# EAGLE design ThermalPrinter (EAGLE 7.6.0)
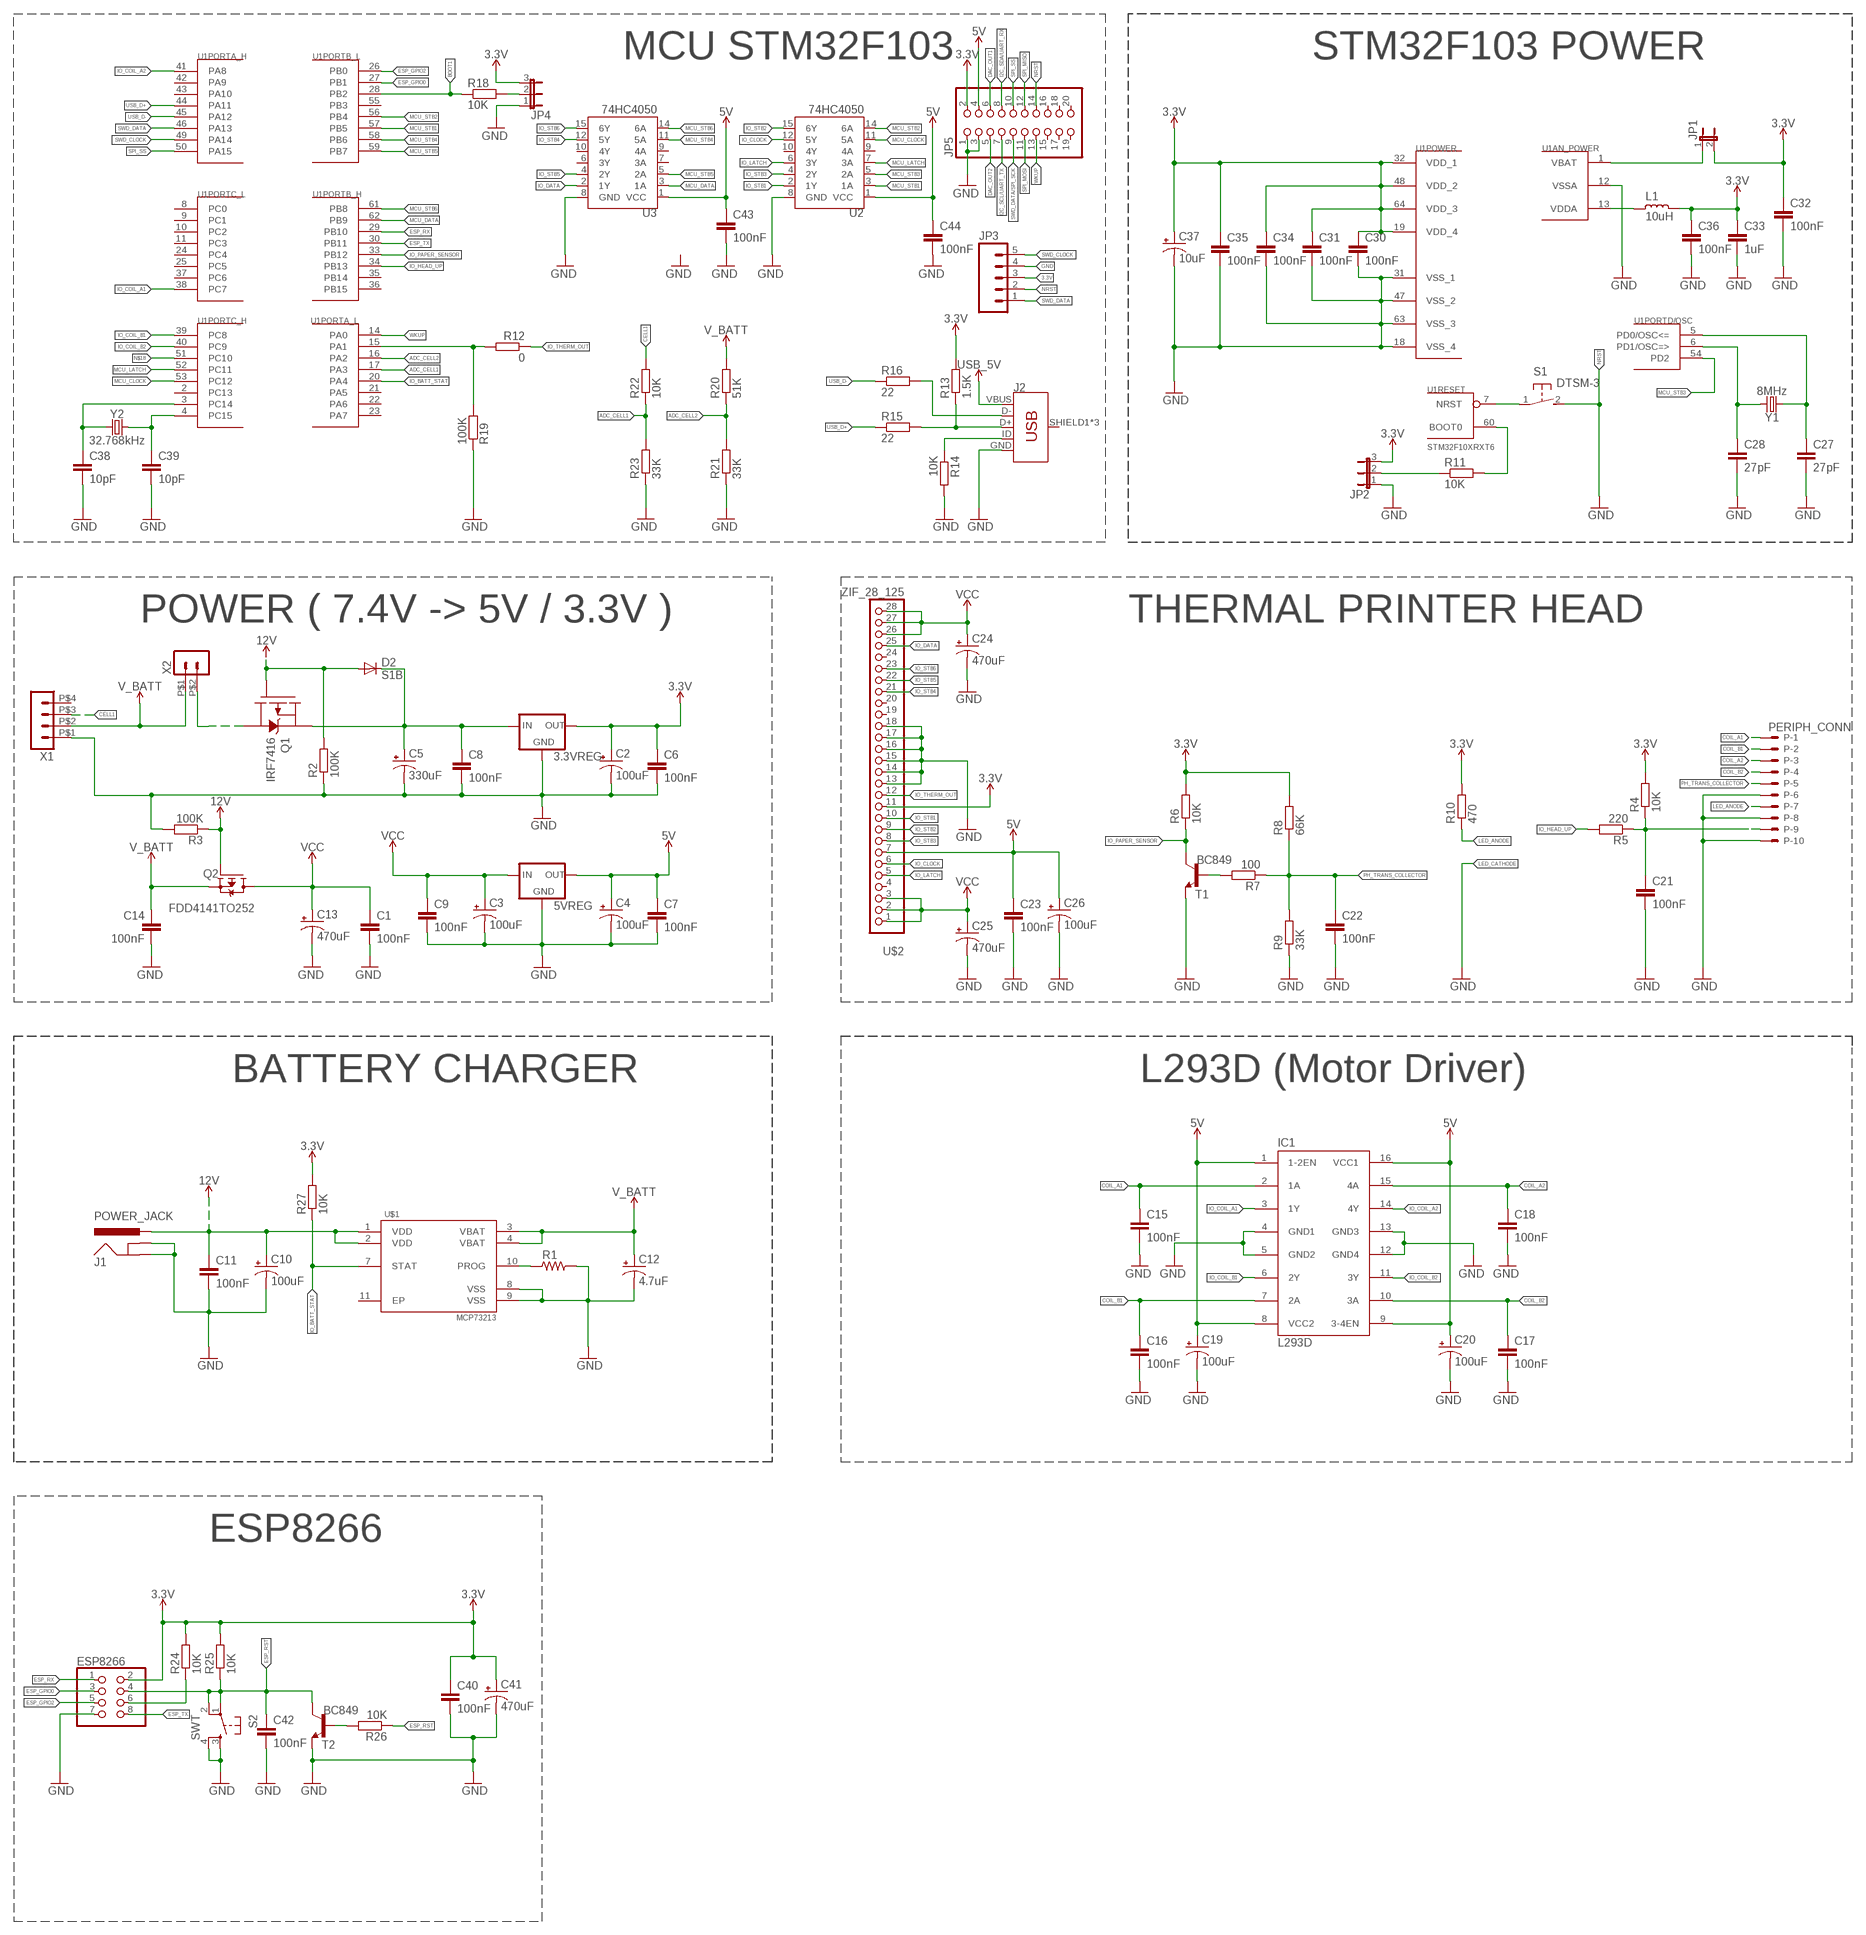
[diagram p0: schematic, sheet 1]

## Parts
3.3VREG  LM1117TO252  [TO252]
5VREG  LM1117TO252  [TO252]
C1  100nF  C-EUC0805K  [C0805K]
C2  100uF  100UF-POLAR-RADIAL-2.5MM-25V-20%  [CPOL-RADIAL-2.5MM-6.5MM]
C3  100uF  100UF-POLAR-RADIAL-2.5MM-25V-20%  [CPOL-RADIAL-2.5MM-6.5MM]
C4  100uF  100UF-POLAR-RADIAL-2.5MM-25V-20%  [CPOL-RADIAL-2.5MM-6.5MM]
C5  330uF  100UF-POLAR-RADIAL-2.5MM-25V-20%  [CPOL-RADIAL-2.5MM-6.5MM]
C6  100nF  C-EUC0805K  [C0805K]
C7  100nF  C-EUC0805K  [C0805K]
C8  100nF  C-EUC0805K  [C0805K]
C9  100nF  C-EUC0805K  [C0805K]
C10  100uF  100UF-POLAR-RADIAL-2.5MM-25V-20%  [CPOL-RADIAL-2.5MM-6.5MM]
C11  100nF  C-EUC0805K  [C0805K]
C12  4.7uF  100UF-POLAR-RADIAL-2.5MM-25V-20%  [CPOL-RADIAL-2.5MM-6.5MM]
C13  470uF  100UF-POLAR-RADIAL-2.5MM-25V-20%  [CPOL-RADIAL-2.5MM-6.5MM]
C14  100nF  C-EUC0805K  [C0805K]
C15  100nF  C-EUC0805K  [C0805K]
C16  100nF  C-EUC0805K  [C0805K]
C17  100nF  C-EUC0805K  [C0805K]
C18  100nF  C-EUC0805K  [C0805K]
C19  100uF  100UF-POLAR-RADIAL-2.5MM-25V-20%  [CPOL-RADIAL-2.5MM-6.5MM]
C20  100uF  100UF-POLAR-RADIAL-2.5MM-25V-20%  [CPOL-RADIAL-2.5MM-6.5MM]
C21  100nF  C-EUC0805K  [C0805K]
C22  100nF  C-EUC0805K  [C0805K]
C23  100nF  C-EUC0805K  [C0805K]
C24  470uF  100UF-POLAR-RADIAL-2.5MM-25V-20%  [CPOL-RADIAL-2.5MM-6.5MM]
C25  470uF  100UF-POLAR-RADIAL-2.5MM-25V-20%  [CPOL-RADIAL-2.5MM-6.5MM]
C26  100uF  100UF-POLAR-RADIAL-2.5MM-25V-20%  [CPOL-RADIAL-2.5MM-6.5MM]
C27  27pF  C-EUC0603  [C0603]
C28  27pF  C-EUC0603  [C0603]
C30  100nF  C-EUC0805K  [C0805K]
C31  100nF  C-EUC0805K  [C0805K]
C32  100nF  C-EUC0805K  [C0805K]
C33  1uF  2.2UF-CERCAP-10009  [1206]
C34  100nF  C-EUC0805K  [C0805K]
C35  100nF  C-EUC0805K  [C0805K]
C36  100nF  C-EUC0805K  [C0805K]
C37  10uF  10UF-TANT  [EIA3216]
C38  10pF  C-EUC0603  [C0603]
C39  10pF  C-EUC0603  [C0603]
C40  100nF  C-EUC0805K  [C0805K]
C41  470uF  100UF-POLAR-RADIAL-2.5MM-25V-20%  [CPOL-RADIAL-2.5MM-6.5MM]
C42  100nF  C-EUC0805K  [C0805K]
C43  100nF  C-EUC0805K  [C0805K]
C44  100nF  C-EUC0805K  [C0805K]
D2  S1B  [DO214AC]
ESP8266  PINHD-2X4  [2X04]
IC1  L293D  [DIL16]
J1  POWER_JACK  [POWER_JACK_PTH]
J2  USB_MICRO-B_FEMALE-SMT  [USB-B-MICRO-SMD]
JP1  JP1E  [JP1]
JP2  JP2E  [JP2]
JP3  M05PTH  [1X05]
JP4  JP2E  [JP2]
JP5  PINHD-2X10  [2X10]
L1  10uH  L_0603  [L0603]
P  PERIPH_CONN  53261-10  [53261-10]
Q1  IRF7416  [SO8-IRFET-1]
Q2  FDD4141TO252  [TO252]
R1  R_0805  [R0805]
R2  100K  R-EU_R0805  [R0805]
R3  100K  R-EU_R0805  [R0805]
R4  10K  R-EU_R0603  [R0603]
R5  220  R-EU_R0603  [R0603]
R6  10K  R-EU_R0603  [R0603]
R7  100  R-EU_R0603  [R0603]
R8  66K  R-EU_R0603  [R0603]
R9  33K  R-EU_R0603  [R0603]
R10  470  R-EU_R0603  [R0603]
R11  10K  R-EU_R0603  [R0603]
R12  0  R-EU_R0603  [R0603]
R13  1.5K  R-EU_R0603  [R0603]
R14  10K  R-EU_R0603  [R0603]
R15  22  R-EU_R0603  [R0603]
R16  22  R-EU_R0603  [R0603]
R18  10K  R-EU_R0603  [R0603]
R19  100K  R-EU_R0603  [R0603]
R20  51K  R-EU_R0603  [R0603]
R21  33K  R-EU_R0603  [R0603]
R22  10K  R-EU_R0603  [R0603]
R23  33K  R-EU_R0603  [R0603]
R24  10K  R-EU_R0603  [R0603]
R25  10K  R-EU_R0603  [R0603]
R26  10K  R-EU_R0603  [R0603]
R27  10K  R-EU_R0603  [R0603]
S1  DTSM-3  [DTSM-3]
S2  SWT  TAC_SWITCHSMD  [TACTILE-SWITCH-SMD]
T1  BC849  [SOT23]
T2  BC849  [SOT23]
U1  STM32F10XRXT6  [TQFP64]
U2  74HC4050  HEX_CONVERTER  [SO16]
U3  74HC4050  HEX_CONVERTER  [SO16]
U$1  MCP73213  [MCP73213]
U$2  ZIF_28_125  [ZIF_CONN_125]
X1  HEADER_POS4_44914-0401  [44914-0401]
X2  HEADER_POS2_43650-0215  [43650-0215]
Y1  8MHz  CRYSTAL-8MHZSMD-HC49UP  [HC49UP]
Y2  32.768kHz  CRYSTAL-32.768KHZSMD-2X6  [CRYSTAL-SMD-2X6-CYL]

## Nets
3.3V: 3.3VREG.3(OUT) C2.1(+) C6.1 C30.1 C31.1 C32.1 C33.1 C34.1 C35.1 C36.1 C37.A(+) C40.1 C41.1(+) ESP8266.2 JP1.2 JP2.3 JP3.3 JP4.3 JP5.2 L1.1 R4.2 R6.2 R8.2 R10.2 R13.2 R24.2 R25.2 R27.2 U1.19(POWER:VDD_4) U1.32(POWER:VDD_1) U1.48(POWER:VDD_2) U1.64(POWER:VDD_3) U$2.11
5V: 5VREG.3(OUT) C4.1(+) C7.1 C19.1(+) C20.1(+) C23.1 C26.1(+) C43.1 C44.1 IC1.1(1-2EN) IC1.8(VCC2) IC1.9(3-4EN) IC1.16(VCC1) JP5.4 U2.1(VCC) U3.1(VCC) U$2.7
12V: C10.1(+) C11.1 D2.A J1.PWR Q1.GATE(G) Q2.1(G) R2.2 R3.1 U$1.1(VDD) U$1.2(VDD)
ADC_CELL1: R22.1 R23.2 U1.17(PORTA_L:PA3)
ADC_CELL2: R20.1 R21.2 U1.16(PORTA_L:PA2)
BOOT1: R18.1 U1.28(PORTB_L:PB2)
CELL1: R22.2 X1.P$3
COIL_A1: C15.1 IC1.2(1A) P.1
COIL_A2: C18.1 IC1.15(4A) P.3
COIL_B1: C16.1 IC1.7(2A) P.2
COIL_B2: C17.1 IC1.10(3A) P.4
D+: J2.D+ R13.1 R15.2
DAC_OUT1: JP5.6
DAC_OUT2: JP5.5
ESP_CH_PD: ESP8266.6 R24.1
ESP_GPIO0: ESP8266.3 U1.27(PORTB_L:PB1)
ESP_GPIO2: ESP8266.5 U1.26(PORTB_L:PB0)
ESP_RST: C42.1 ESP8266.4 R25.1 R26.1 S2.1 S2.2 T2.3(C)
ESP_RX: ESP8266.1 U1.29(PORTB_H:PB10)
ESP_TX: ESP8266.8 U1.30(PORTB_H:PB11)
GND: 3.3VREG.1(GND) 5VREG.1(GND) C1.2 C2.2(-) C3.2(-) C4.2(-) C5.2(-) C6.2 C7.2 C8.2 C9.2 C10.2(-) C11.2 C12.2(-) C13.2(-) C14.2 C15.2 C16.2 C17.2 C18.2 C19.2(-) C20.2(-) C21.2 C22.2 C23.2 C24.2(-) C25.2(-) C26.2(-) C27.2 C28.2 C30.2 C31.2 C32.2 C33.2 C34.2 C35.2 C36.2 C37.C(-) C38.2 C39.2 C40.2 C41.2(-) C42.2 C43.2 C44.2 ESP8266.7 IC1.4(GND1) IC1.5(GND2) IC1.12(GND4) IC1.13(GND3) J1.GND J1.GNDBREAK J2.GND JP2.1 JP3.4 JP4.1 JP5.1 JP5.3 P.6 P.8 P.10 R1.2 R2.1 R3.2 R9.1 R14.2 R19.1 R21.1 R23.1 S2.3 S2.4 T1.2(E) T2.2(E) U1.12(AN_POWER:VSSA) U1.18(POWER:VSS_4) U1.31(POWER:VSS_1) U1.47(POWER:VSS_2) U1.63(POWER:VSS_3) U2.8(GND) U3.8(GND) U$1.8(VSS) U$1.9(VSS) U$2.13 U$2.14 U$2.15 U$2.16 U$2.17 U$2.18 X1.P$1
HEAD_UP_IN: C21.1 P.9 R4.1 R5.1
I2C_SCL/UART_TX: JP5.7
I2C_SDA/UART_RX: JP5.8
IO_BATT_STAT: R27.1 U1.20(PORTA_L:PA4) U$1.7(STAT)
IO_CLOCK: U2.12(5Y) U$2.6
IO_COIL_A1: IC1.3(1Y) U1.38(PORTC_L:PC7)
IO_COIL_A2: IC1.14(4Y) U1.41(PORTA_H:PA8)
IO_COIL_B1: IC1.6(2Y) U1.39(PORTC_H:PC8)
IO_COIL_B2: IC1.11(3Y) U1.40(PORTC_H:PC9)
IO_DATA: U3.2(1Y) U$2.25
IO_HEAD_UP: R5.2 U1.34(PORTB_H:PB13)
IO_LATCH: U2.6(3Y) U$2.5
IO_PAPER_SENSOR: R6.1 T1.3(C) U1.33(PORTB_H:PB12)
IO_STB1: U2.2(1Y) U$2.10
IO_STB2: U2.15(6Y) U$2.9
IO_STB3: U2.4(2Y) U$2.8
IO_STB4: U3.12(5Y) U$2.21
IO_STB5: U3.4(2Y) U$2.22
IO_STB6: U3.15(6Y) U$2.23
IO_THERM_OUT: R12.1 U$2.12
LED_ANODE: P.7 R10.1
MCU_CLOCK: U1.53(PORTC_H:PC12) U2.11(5A)
MCU_DATA: U1.62(PORTB_H:PB9) U3.3(1A)
MCU_LATCH: U1.52(PORTC_H:PC11) U2.7(3A)
MCU_STB1: U1.57(PORTB_L:PB5) U2.3(1A)
MCU_STB2: U1.56(PORTB_L:PB4) U2.14(6A)
MCU_STB3: U1.54(PORTD/OSC:PD2) U2.5(2A)
MCU_STB4: U1.58(PORTB_L:PB6) U3.11(5A)
MCU_STB5: U1.59(PORTB_L:PB7) U3.5(2A)
MCU_STB6: U1.61(PORTB_H:PB8) U3.14(6A)
N$1: S1.1 U1.7(RESET:NRST)
N$2: 3.3VREG.2(IN) C5.1(+) C8.1 D2.C Q1.SOURCE-1(S)
N$3: R7.2 T1.1(B)
N$4: R1.1 U$1.10(PROG)
N$5: C28.1 U1.6(PORTD/OSC:PD1/OSC=>) Y1.2
N$6: L1.2 U1.13(AN_POWER:VDDA)
N$7: C27.1 U1.5(PORTD/OSC:PD0/OSC<=) Y1.1
N$8: JP1.1 U1.1(AN_POWER:VBAT)
N$9: Q1.DRAIN-4(D) X2.P$2
N$10: C38.1 U1.3(PORTC_H:PC14) Y2.X2
N$11: C39.1 U1.4(PORTC_H:PC15) Y2.X1
N$12: J2.ID R14.1
N$14: J2.D- R16.2
N$15: JP4.2 R18.2
N$16: R11.2 U1.60(RESET:BOOT0)
N$17: R26.2 T2.1(B)
N$18: U1.51(PORTC_H:PC10)
N$19: JP2.2 R11.1
N$20: R12.2 R19.2 U1.15(PORTA_L:PA1)
NRST: JP3.2 JP5.14 S1.2 ; supply symbol labelled GND
PH_TRANS_COLLECTOR: C22.1 P.5 R7.1 R8.1 R9.2
SPI_MISO: JP5.12
SPI_MOSI: JP5.11
SPI_SS: JP5.10 U1.50(PORTA_H:PA15)
SWD_CLOCK: JP3.5 U1.49(PORTA_H:PA14)
SWD_DATA: JP3.1 U1.46(PORTA_H:PA13)
SWD_DATA/SPI_SCK: JP5.9
USB_D+: R15.1 U1.44(PORTA_H:PA11)
USB_D-: R16.1 U1.45(PORTA_H:PA12)
V_BATT: C12.1(+) C14.1 Q2.2(S) R20.2 U$1.3(VBAT) U$1.4(VBAT) X1.P$2 X2.P$1
VCC: 5VREG.2(IN) C1.1 C3.1(+) C9.1 C13.1(+) C24.1(+) C25.1(+) Q2.3(D) U$2.1 U$2.2 U$2.3 U$2.26 U$2.27 U$2.28
VCC_2: J2.VBUS ; supply symbol labelled USB_5V
WKUP: JP5.13 U1.14(PORTA_L:PA0)
Unconnected: J2.SHIELD1(SHIELD) J2.SHIELD2(SHIELD) J2.SHIELD3(SHIELD) JP5.15 JP5.16 JP5.17 JP5.18 JP5.19 JP5.20 U1.2(PORTC_H:PC13) U1.8(PORTC_L:PC0) U1.9(PORTC_L:PC1) U1.10(PORTC_L:PC2) U1.11(PORTC_L:PC3) U1.21(PORTA_L:PA5) U1.22(PORTA_L:PA6) U1.23(PORTA_L:PA7) U1.24(PORTC_L:PC4) U1.25(PORTC_L:PC5) U1.35(PORTB_H:PB14) U1.36(PORTB_H:PB15) U1.37(PORTC_L:PC6) U1.42(PORTA_H:PA9) U1.43(PORTA_H:PA10) U1.55(PORTB_L:PB3) U2.9(4A) U2.10(4Y) U3.6(3Y) U3.7(3A) U3.9(4A) U3.10(4Y) U$1.11(EP) U$2.4 U$2.19 U$2.20 U$2.24 X1.P$4

## Notes on the sheet
- MCU STM32F103 | STM32F103 POWER
- POWER ( 7.4V -> 5V / 3.3V ) | THERMAL PRINTER HEAD
- BATTERY CHARGER | L293D (Motor Driver)
- ESP8266

## Library data of the parts
3.3VREG 5VREG = v-reg-3:LM1117
C1 C6-C9 C11 C14-C18 C21-C23 C27 C28 C30-C32 C34-C36 C38-C40 C42-C44 = rcl:C-EU: CAPACITOR, European symbol
C2-C4 C10 C19 C20 C26 = SparkFun-Capacitors:100UF-POLAR: 100µF polarized capacitors A capacitor is a passive two-terminal electrical component used to store electrical energy temporarily in an electric field.; PROD_ID: CAP-08439
C5 C12 C13 C24 C25 C41 = SparkFun-Capacitors:100UF-POLAR: 100µF polarized capacitors A capacitor is a passive two-terminal electrical component used to store electrical energy temporarily in an electric field.; PROD_ID: CAP-08439; VALUE: 100uF
C33 = SparkFun-Retired:2.2UF-CER: 2.2uF Ceramic SMT CAP-07888- 10V, 20% (0603) CAP-10009- 50V, 10% (1206); PROD_ID: CAP-10009; VALUE: 2.2uF
C37 = SparkFun-Retired:10UF-TANT: 10uF Tantalum SMT CAP-00811- 16V 10% (EIA-3216); PROD_ID: CAP-00811
D2 = s1x_10:S1*: S1A - S1M General Purpose Rectifiers Source: http://www.fairchildsemi.com/datasheets/S1/S1A.pdf; MF: Fairchild; MPN: S1B; OC_FARNELL: 2136324; OC_NEWARK: 18C8663
ESP8266 = pinhead:PINHD-2X4: PIN HEADER
IC1 = st-microelectronics:L293D: PUSH-PULL 4 CHANNEL DRIVER; MPN: L293D; OC_FARNELL: 9589619; OC_NEWARK: 56P8249
J1 = SparkFun-Connectors:POWER_JACK: Power Jack Connector This is the standard 5.5mm barrel jack for power. The PTH is the most common, proven, reliable, footprint. The Slot footprint only works if the mill layer is transmitted to the PCB fab house so be warned. Here are the connectors we sell at SparkFun: DC Barrel Power Jack/Connector <https://www.sparkfun.com/products/119> (PRT-00119) DC Barrel Power Jack/Connector (SMD) <https://www.sparkfun.com/products/12748> (PRT-12748) DC Barrel Jack Adapter - Breadboard Compatible <https://www.sparkfun.com/products/10811> (PRT-10811) It is used on this SparkFun product (and many, many others): SparkFun RedBoard - Programmed with Arduino <https://www.sparkfun.com/products/12757> (DEV-12757) Also, if you need a mating power supply or connector, please check these out: Wall Adapter Power Supply - 9VDC 650mA <https://www.sparkfun.com/products/298> (TOL-00298) DC Barrel Jack Adapter - Male <https://www.sparkfun.com/products/10287> (PRT-10287); PROD_ID: CONN-08197
J2 = SparkFun-Connectors:USB_MICRO-B: USB Type Micro-B Connector Male/female and PTH/SMT variants SparkFun Products: SparkFun microB USB Breakout <https://www.sparkfun.com/products/12035> SparkFun USB microB Plug Breakout <https://www.sparkfun.com/products/10031> SparkFun ESP8266 Thing <https://www.sparkfun.com/products/13231>; PROD_ID: CONN-11752
JP1 = jumper:JP1E: JUMPER
JP2 JP4 = jumper:JP2E: JUMPER
JP3 = SparkFun:M05: Header 5 Standard 5-pin 0.1" header. Use with straight break away headers (SKU : PRT-00116), right angle break away headers (PRT-00553), swiss pins (PRT-00743), machine pins (PRT-00117), and female headers (PRT-00115). Molex polarized connector foot print use with SKU : PRT-08230 with associated crimp pins and housings.
JP5 = pinhead:PINHD-2X10: PIN HEADER
L1 = rc-master-smd:L_: INDUCTOR
P = con-molex:53?-10: CONNECTOR wire to board 1.25 mm (.049 inch) pitch header; OC_FARNELL: unknown; OC_NEWARK: unknown
Q1 = transistor:IRF7416: P chan MOSFET, 30V, 35mOhm, 7A; DESC: MOSFET, P channel; DVAL: 30V 7A 35mOhm; SUPPLIER: Mouser:942-IRF7416TRPBF; VALSTAT: partnum
Q2 = transistor-fet:FDD4141: P-Channel PowerTrench® MOSFET Source: FDD4141.pdf
R1 = rc-master-smd:R_: RESISTOR
R2-R16 R18-R27 = resistor:R-EU_: RESISTOR, European symbol
S1 = switch-tact:DTSM-3
S2 = SparkFun-Retired:TAC_SWITCH: Momentary Switch Button commonly used for reset or general input. Spark Fun Electronics SKU : COM-00097 SMT- SWCH-08247; PROD_ID: SWCH-08247; VALUE: TAC_SWITCHSMD
T1 T2 = transistor:BC849: NPN TRANSISTOR
U1 = stm32:STM32F10XRXT6: STM32F101/103 64pin LQFP
U2 U3 = SparkFun-IC-Comms:HEX_CONVERTER: 74HC4050 Hex Buffer 74HC4050 Hex Buffer Level Shifter SMD SO016 SparkFun Products CAN-BUS Shield <https://www.sparkfun.com/products/13262> (DEV-13262) SparkFun MP3 Player Shield <https://www.sparkfun.com/products/12660> (DEV-12660) SparkFun microSD Shield <https://www.sparkfun.com/products/12761> (DEV-12761) SparkFun USB Host Shield <https://www.sparkfun.com/products/9947> (DEV-09947); PROD_ID: IC-09604
U$1 = Microchip:MCP73213
U$2 = ZIF_CONN:ZIF_28_125
X1 = con-molex-micro-fit-3_0:HEADER_POS4_?: Molex - Micro-Fit 3.0 Series connector, 3.00mm (0.118") pitch header, 4 positions.
X2 = con-molex-micro-fit-3_0:HEADER_POS2_?: Molex - Micro-Fit 3.0 Series connector, 3.00mm (0.118") pitch header, 2 positions.
Y1 = SparkFun-Clocks:CRYSTAL-8MHZ: 8MHz Crystal Datasheet Example <http://www.futureelectronics.com/en/technologies/electromechanical/timing-devices/crystals/Pages/6008189-ABM3B-8.000MHZ-B2-T.aspx?IM=0> Frequency: 8MHz Frequency Tolerance: ±20ppm Load Capacitance: 18pF SparkFun Products: Pro Micro -3.3V/8MHz <https://www.sparkfun.com/products/12587> WAV Trigger <https://www.sparkfun.com/products/13660>; PROD_ID: XTAL-11706
Y2 = SparkFun-Clocks:CRYSTAL-32.768KHZ: 32.768kHz Crystal Frequency: 32.768kHz Frequency Stability: ±20ppm Load Capacitance: 12.5pF (PTH-2X6 & SMD-3.2X1.5), 6pF (SMD-2X6) SparkFun Products: SparkFun BigTime Watch Kit <https://www.sparkfun.com/products/11734> SparkFun nRF52832 Breakout <https://www.sparkfun.com/products/13990> SparkFun Real Time Clock Module <https://www.sparkfun.com/products/12708>; PROD_ID: XTAL-07894

## Board
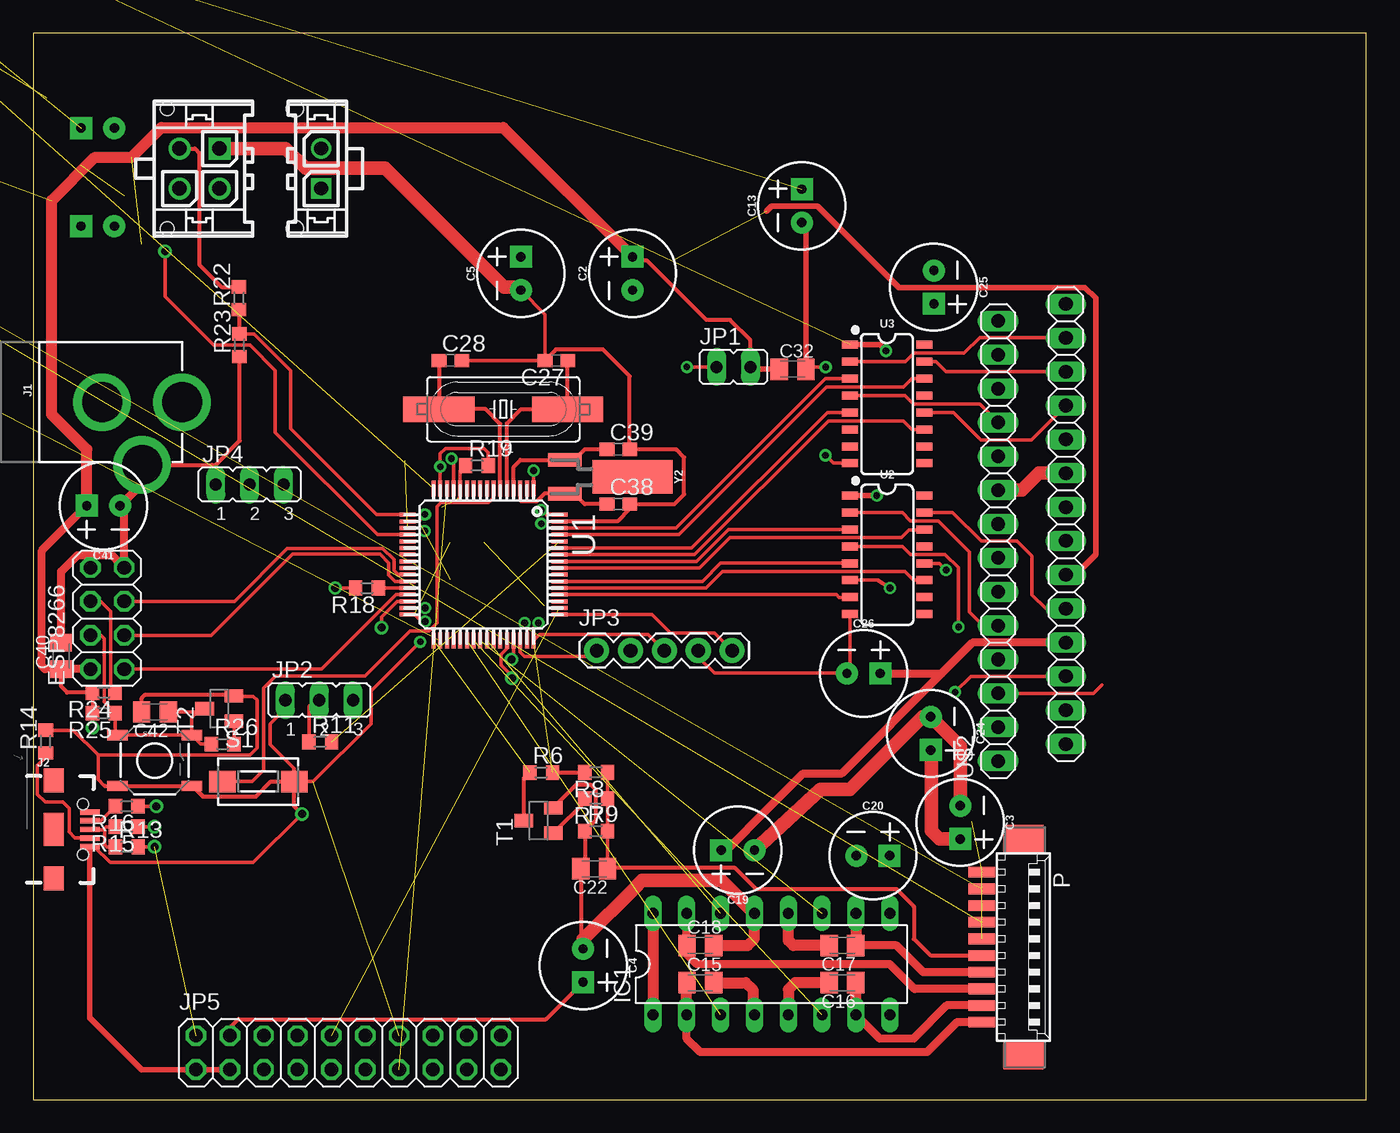
[diagram p1: board, top side]
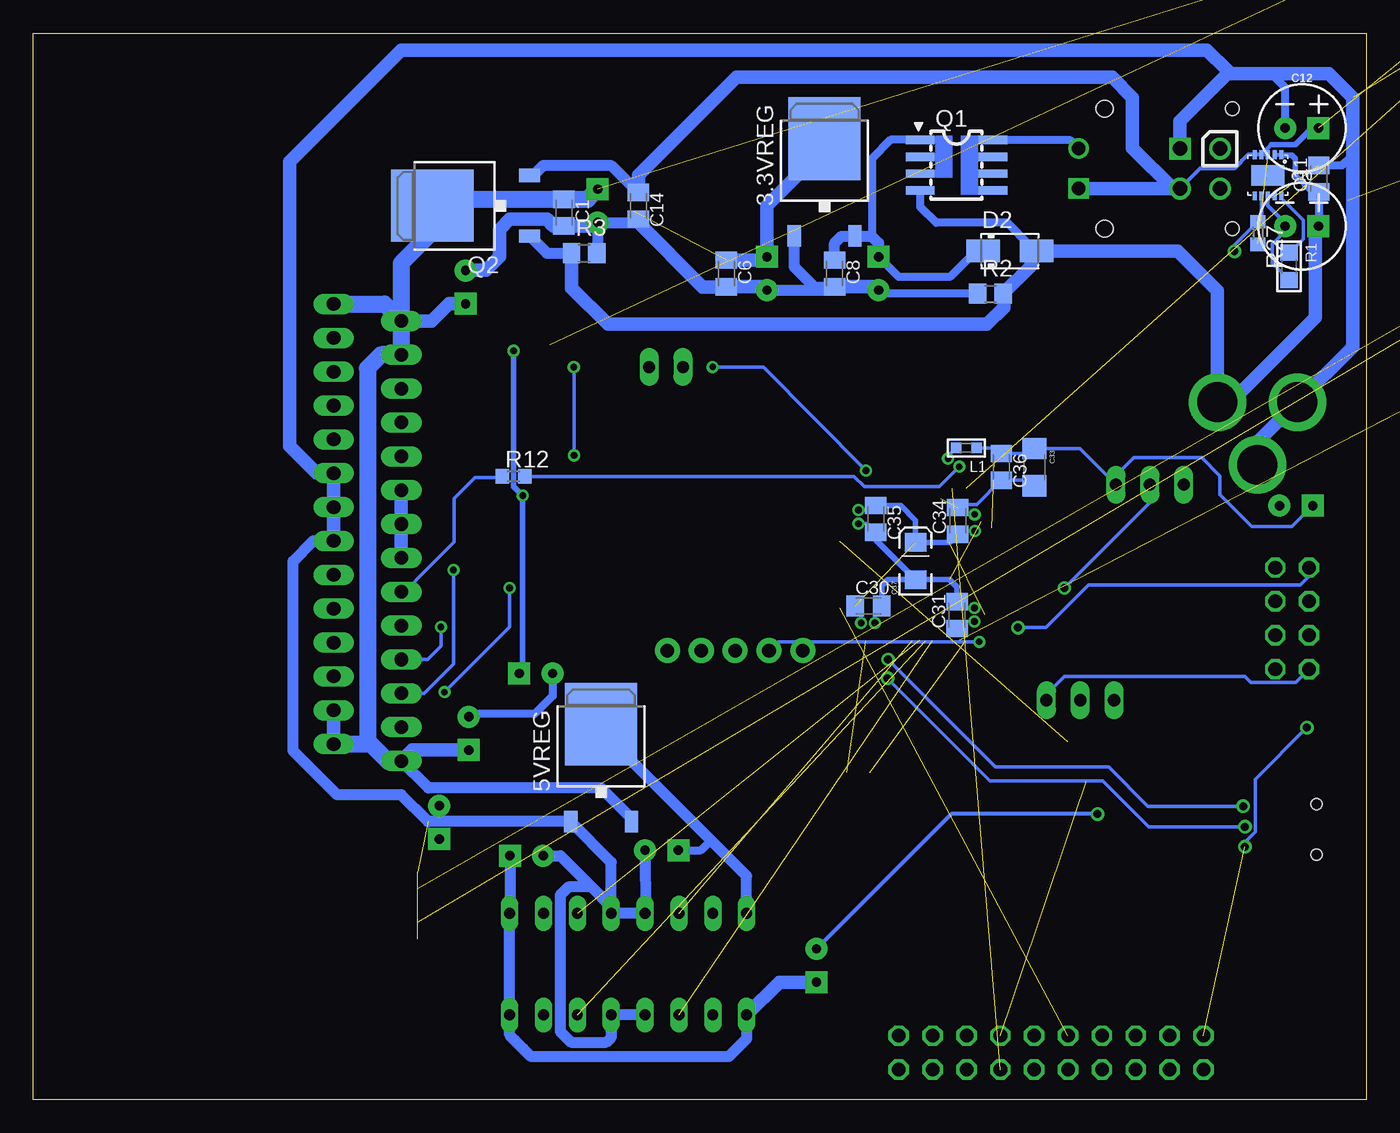
[diagram p2: board, bottom side, seen from below]

Size 100 x 80 mm. Coordinates in mm from the lower left corner, seen from the top.
Outline: 0,0 100,0 100,80 0,80 0,0
Copper layers (1*16): Top 0.035mm / dielectric 1.5mm / Bottom 0.035mm
Design rules "default": minimum track width 10mil, minimum drill 24mil, track to track 8mil, track to pad 8mil, pad to pad 8mil, via to via 8mil, smd to smd 8mil, copper to edge 40mil, drill to drill 8mil, minimum pad ring 10mil, minimum via ring 8mil, stop-mask expansion 4mil, vias tented up to drill 0mil, thermal gap 10mil

### Footprints (pad centres in the part's own frame; a part is rotated, then mirrored left to right if it is on the bottom)
TO252 = smd 1 x 1.6: 1 -2.28,-6.07; 2 2.28,-6.07 | smd 5.4 x 6.2: 3 0,1.23
C0805K = smd 1.3 x 1.6: 1 -1,0; 2 1,0
CPOL-RADIAL-2.5MM-6.5MM = drill 0.7 pad 1.651 square: 1 1.25,0 | drill 0.7 pad 1.651: 2 -1.25,0
C0603 = smd 1.1 x 1: 1 -0.85,0; 2 0.85,0
1206 = smd 1.6 x 1.8: 1 -1.4,0; 2 1.4,0
EIA3216 = smd 1.4 x 1.6: A 1.4,0; C -1.4,0
DO214AC = smd 2.5 x 1.7: A 2,0; C -2,0
2X04 = drill 1.016 octagon: 1 -3.81,-1.27; 2 -3.81,1.27; 3 -1.27,-1.27; 4 -1.27,1.27; 5 1.27,-1.27; 6 1.27,1.27; 7 3.81,-1.27; 8 3.81,1.27
DIL16 = drill 0.813 long: 1 -8.89,-3.81; 2 -6.35,-3.81; 3 -3.81,-3.81; 4 -1.27,-3.81; 5 1.27,-3.81; 6 3.81,-3.81; 7 6.35,-3.81; 8 8.89,-3.81; 9 8.89,3.81; 10 6.35,3.81; 11 3.81,3.81; 12 1.27,3.81; 13 -1.27,3.81; 14 -3.81,3.81; 15 -6.35,3.81; 16 -8.89,3.81
POWER_JACK_PTH = drill 2.997 pad 4.318: GND 0,7.7; GNDBREAK 4.7,10.7; PWR 0,13.7
USB-B-MICRO-SMD = smd 1.45 x 0.4: D+ 2.725,0; D- 2.725,0.65; GND 2.725,-1.3; ID 2.725,-0.65; VBUS 2.725,1.3 | smd 1.5 x 1.8: SHIELD1 0,3.685; SHIELD2 0,-3.685 | smd 1.5 x 2.5: SHIELD3 0,0 | hole 0.85: 2.2,1.9; 2.2,-1.9
JP1 = drill 0.914 long: 1 0,-1.27; 2 0,1.27
JP2 = drill 0.914 long: 1 -2.54,0; 2 0,0; 3 2.54,0
1X05 = drill 1.016 pad 1.88: 1 0,0; 2 2.54,0; 3 5.08,0; 4 7.62,0; 5 10.16,0
2X10 = drill 1.016 octagon: 1 -11.43,-1.27; 2 -11.43,1.27; 3 -8.89,-1.27; 4 -8.89,1.27; 5 -6.35,-1.27; 6 -6.35,1.27; 7 -3.81,-1.27; 8 -3.81,1.27; 9 -1.27,-1.27; 10 -1.27,1.27; 11 1.27,-1.27; 12 1.27,1.27; 13 3.81,-1.27; 14 3.81,1.27; 15 6.35,-1.27; 16 6.35,1.27; 17 8.89,-1.27; 18 8.89,1.27; 19 11.43,-1.27; 20 11.43,1.27
L0603 = smd 0.8 x 0.8: 1 -0.762,0; 2 0.762,0
53261-10 = smd 0.8 x 2: 1 5.625,-2.5; 2 4.375,-2.5; 3 3.125,-2.5; 4 1.875,-2.5; 5 0.625,-2.5; 6 -0.625,-2.5; 7 -1.875,-2.5; 8 -3.125,-2.5; 9 -4.375,-2.5; 10 -5.625,-2.5 | smd 2.1 x 3: S1 8.125,0.625; S2 -8.125,0.625
SO8-IRFET-1 = smd 0.635 x 2.159: DRAIN-1 1.905,2.731; DRAIN-2 0.635,2.731; DRAIN-3 -0.635,2.731; DRAIN-4 -1.905,2.731; GATE 1.905,-2.731; SOURCE-1 -1.905,-2.731; SOURCE-2 -0.635,-2.731; SOURCE-3 0.635,-2.731
TO252' = smd 1 x 1.6: 1 -2.28,-4.8; 2 2.28,-4.8 | smd 5.4 x 6.2: 3 0,2.5
R0805 = smd 1.2 x 1.3: 1 -1.016,0; 2 1.016,0
R0805' = smd 1.3 x 1.5: 1 -0.95,0; 2 0.95,0
R0603 = smd 1 x 1.1: 1 -0.85,0; 2 0.85,0
DTSM-3 = smd 2 x 1.6: 1 -2.7,0; 2 2.7,0
TACTILE-SWITCH-SMD = smd 1.524 x 0.762: 1 -2.794,1.905; 2 2.794,1.905; 3 -2.794,-1.905; 4 2.794,-1.905
SOT23 = smd 1 x 1.4: 1 -0.95,-1.1; 2 0.95,-1.1; 3 0,1.1
TQFP64 = smd 1.2 x 0.3: 1 -5.7,3.75; 2 -5.7,3.25; 3 -5.7,2.75; 4 -5.7,2.25; 5 -5.7,1.75; 6 -5.7,1.25; 7 -5.7,0.75; 8 -5.7,0.25; 9 -5.7,-0.25; 10 -5.7,-0.75; 11 -5.7,-1.25; 12 -5.7,-1.75; 13 -5.7,-2.25; 14 -5.7,-2.75; 15 -5.7,-3.25; 16 -5.7,-3.75; 33 5.7,-3.75; 34 5.7,-3.25; 35 5.7,-2.75; 36 5.7,-2.25; 37 5.7,-1.75; 38 5.7,-1.25; 39 5.7,-0.75; 40 5.7,-0.25; 41 5.7,0.25; 42 5.7,0.75; 43 5.7,1.25; 44 5.7,1.75; 45 5.7,2.25; 46 5.7,2.75; 47 5.7,3.25; 48 5.7,3.75 | smd 0.3 x 1.2: 17 -3.75,-5.7; 18 -3.25,-5.7; 19 -2.75,-5.7; 20 -2.25,-5.7; 21 -1.75,-5.7; 22 -1.25,-5.7; 23 -0.75,-5.7; 24 -0.25,-5.7; 25 0.25,-5.7; 26 0.75,-5.7; 27 1.25,-5.7; 28 1.75,-5.7; 29 2.25,-5.7; 30 2.75,-5.7; 31 3.25,-5.7; 32 3.75,-5.7; 49 3.75,5.7; 50 3.25,5.7; 51 2.75,5.7; 52 2.25,5.7; 53 1.75,5.7; 54 1.25,5.7; 55 0.75,5.7; 56 0.25,5.7; 57 -0.25,5.7; 58 -0.75,5.7; 59 -1.25,5.7; 60 -1.75,5.7; 61 -2.25,5.7; 62 -2.75,5.7; 63 -3.25,5.7; 64 -3.75,5.7
SO16 = smd 0.6 x 1.2: 1 -4.445,-2.8; 2 -3.175,-2.8; 3 -1.905,-2.8; 4 -0.635,-2.8; 5 0.635,-2.8; 6 1.905,-2.8; 7 3.175,-2.8; 8 4.445,-2.8; 9 4.445,2.8; 10 3.175,2.8; 11 1.905,2.8; 12 0.635,2.8; 13 -0.635,2.8; 14 -1.905,2.8; 15 -3.175,2.8; 16 -4.445,2.8
MCP73213 = smd 0.65 x 0.3: 1 -1.55,1; 2 -1.55,0.5; 3 -1.55,0; 4 -1.55,-0.5; 5 -1.55,-1; 6 1.55,-1; 7 1.55,-0.5; 8 1.55,0; 9 1.55,0.5; 10 1.55,1 | smd 1.55 x 2.48: 11 0,0
ZIF_CONN_125 = drill 1.016 long: 1 -2.54,15.24; 2 2.54,16.51; 3 -2.54,12.7; 4 2.54,13.97; 5 -2.54,10.16; 6 2.54,11.43; 7 -2.54,7.62; 8 2.54,8.89; 9 -2.54,5.08; 10 2.54,6.35; 11 -2.54,2.54; 12 2.54,3.81; 13 -2.54,0; 14 2.54,1.27; 15 -2.54,-2.54; 16 2.54,-1.27; 17 -2.54,-5.08; 18 2.54,-3.81; 19 -2.54,-7.62; 20 2.54,-6.35; 21 -2.54,-10.16; 22 2.54,-8.89; 23 -2.54,-12.7; 24 2.54,-11.43; 25 -2.54,-15.24; 26 2.54,-13.97; 27 -2.54,-17.78; 28 2.54,-16.51
44914-0401 = drill 1.09 square: P$1 1.5,0 | drill 1.09: P$2 -1.5,0; P$3 1.5,3; P$4 -1.5,3 | hole 1.02: 4.5,3.94; -4.5,3.94
43650-0215 = drill 1.02 square: P$1 1.5,0 | drill 1.02: P$2 -1.5,0 | hole 1.27: 4.5,-1.96; -4.5,-1.96
HC49UP = smd 5.334 x 1.93: 1 -4.826,0; 2 4.826,0
CRYSTAL-SMD-2X6-CYL = smd 2.5 x 6: SHEILD 0,5.08 | smd 1 x 2.5: X1 -1.27,0; X2 1.27,0

### Placement (x,y rotation side)
3.3VREG  40.64,70.87 0 bottom
5VREG  57.4,26.92 0 bottom
C1  60.2,66.55 270 bottom
C2  44.96,61.98 90 top
C3  69.55,20.79 270 top
C4  41.25,10.06 270 top
C5  36.58,61.98 90 top
C6  48.01,61.98 270 bottom
C7  -25.4,97.79 0 top  (outside the outline)
C8  39.88,61.98 270 bottom
C9  -35.56,97.79 0 top  (outside the outline)
C10  4.83,65.53 0 bottom
C11  3.56,69.09 90 bottom
C12  4.83,72.9 0 bottom
C13  57.66,67.06 90 top
C14  54.61,67.06 270 bottom
C15  50.04,8.76 0 top
C16  60.71,8.76 180 top
C17  60.71,11.56 180 top
C18  50.04,11.56 0 top
C19  52.86,18.71 180 top
C20  62.99,18.29 0 top
C21  -71.12,97.79 0 top  (outside the outline)
C22  42.08,17.32 180 top
C23  -81.28,97.79 0 top  (outside the outline)
C24  67.34,27.47 270 top
C25  67.56,60.96 270 top
C26  62.29,31.97 0 top
C27  39.24,55.45 180 top
C28  31.29,55.45 0 top
C30  37.34,37.03 0 bottom
C31  30.7,36.35 90 bottom
C32  56.97,54.79 0 top
C33  24.89,47.45 270 bottom
C34  30.65,43.42 90 bottom
C35  36.79,43.57 270 bottom
C36  27.37,47.47 270 bottom
C37  33.81,40.41 90 bottom
C38  43.89,44.68 0 top
C39  43.89,48.78 0 top
C40  2.08,33.29 90 top
C41  5.26,44.55 180 top
C42  9.13,29.08 180 top
C43  -60.96,102.87 0 top  (outside the outline)
C44  -66.04,102.87 0 top  (outside the outline)
D2  26.73,63.67 0 bottom
ESP8266  5.55,36.11 90 top
IC1  55.37,10.16 0 top
J1  -2.54,52.32 270 top
J2  1.52,20.27 0 top
JP1  52.53,54.97 270 top
JP2  21.45,29.96 0 top
JP3  42.27,33.68 0 top
JP4  16.23,46.14 0 top
JP5  23.63,3.52 0 top
L1  30,48.9 180 bottom
P  73.66,11.43 270 top
Q1  30.73,70.1 270 bottom
Q2  FDD4141TO252  [TO252']  67.56,67.06 90 bottom
R1  5.78,62.51 270 bottom
R2  100K  [R0805']  28.19,60.45 0 bottom
R3  100K  [R0805']  58.67,63.5 0 bottom
R4  -62.23,92.71 0 top  (outside the outline)
R5  -82.55,92.71 0 top  (outside the outline)
R6  38.1,24.54 0 top
R7  42.23,22.57 180 top
R8  42.23,24.55 180 top
R9  42.23,20.14 0 top
R10  -53.34,87.63 0 top  (outside the outline)
R11  21.53,26.84 0 top
R12  63.97,46.76 0 bottom
R13  7.02,18.96 0 top
R14  0.93,26.86 90 top
R15  7.01,20.47 180 top
R16  7.01,22.01 180 top
R18  25.03,38.38 180 top
R19  33.29,47.57 0 top
R20  -21.59,92.71 0 top  (outside the outline)
R21  -26.67,92.71 0 top  (outside the outline)
R22  15.43,60.12 90 top
R23  15.47,56.59 90 top
R24  5.28,30.54 180 top
R25  5.3,28.99 180 top
R26  14.21,26.67 0 top
R27  8.13,65.02 270 bottom
S1  16.88,23.85 0 top
S2  9.11,25.44 0 top
T1  37.91,20.93 90 top
T2  13.96,29.34 90 top
U1  33.78,40.13 270 top
U2  64.07,40.87 270 top
U3  64.06,52.18 270 top
U$1  7.37,69.34 270 bottom
U$2  74.93,41.91 180 top
X1  13.97,69.85 90 top
X2  21.59,69.85 270 top
Y1  35.26,51.79 180 top
Y2  39.87,46.72 270 top

### Tracks (layer width: path | path; a pad name or v marks a point on that pad's centre or on a via)
3.3V  (via drill 0.5, 0.6)  (9 unrouted)
  Top 0.254: R24.2 4.45,30.53 R25.2 v4.45,27.9 | U1.32 28.62,36.38 29.13,35.87 v29.39,35.87 | U1.19 29.05,42.88 v29.36,42.66 | v37.9,35.75 37.53,35.39 U1.48 38,34.9 46.13,34.9 JP3.3 | R13.2 v9.09,18.96
  Top 0.305: JP1.2 53.8,56.97 52.27,58.5 50.49,58.5 46.02,62.98 45.21,62.98 C2.1 | R24.2 2.53,30.54 2.1,30.98 2.1,32.27 C40.1 | R6.2 41.37,24.54 R8.2 | U1.64 38.53,43.88 v38.1,44.23
  Top 0.406: C32.1 53.98,54.79 JP1.2 | U$2.11 78.19,39.37 79.72,40.89 79.72,60.12 78.91,60.94 64.94,60.94 58.83,67.04 55.38,67.04 55,66.66
  Top 0.61: C40.1 2.09,32.3 ESP8266.2 0.86,32.3 0.64,32.52 0.64,41.18 C41.1
  Top 0.813: C41.1 4.01,48.77 1.37,51.41 1.37,67.46 4.61,70.7 7.37,70.7 9.6,72.94 35.25,72.94 C2.1
  Bottom 0.254: JP2.3 23.99,30.39 23.05,31.33 23.04,31.33 22.63,31.74 9.12,31.74 8.67,31.29 5.28,31.29 ESP8266.2 | C41.1 5.57,42.99 8.57,42.99 10.99,45.4 10.99,46.8 12.34,48.16 17.42,48.16 18.77,46.81 JP4.3 21.48,48.85 C33.1 25.27,48.47 C36.1 | v29.39,35.87 30.19,35.85 C31.1 | v29.36,42.66 30.46,42.67 C34.1 | 27.89,47.95 C36.1 | v37.9,35.75 37.9,36.48 C30.1 | L1.1 27.79,48.9 C36.1 | v4.45,27.9 8.32,24.03 8.32,20.07 9.03,19.36 9.03,19.02 v9.09,18.96
  Bottom 0.305: v38.1,44.23 37.13,44.23 C35.1
  Bottom 0.406: C34.1 31.25,41.81 C37.A 33.81,43.46 34.92,44.58 C35.1
  Bottom 1.016: 3.3VREG.3 40.64,71.37 44.96,67.06 C2.1 45.21,62.98 C6.1
5V  (via drill 0.5)  (4 unrouted)
  Top 0.305: JP5.4 14.74,5.38 15.38,6.02 38.46,6.02 C4.1
  Top 0.406: U3.1 63.51,56.63 v63.97,56.17 | v63.28,45.31 U2.1
  Top 0.61: U$2.7 70.46,34.29 68.14,31.97 | 68.14,31.97 60.62,24.45 57.77,24.45 57.76,24.46 54.91,21.61 54.9,21.61 54.9,21.6 52.23,18.94 51.84,18.94 C19.1 | C26.1 68.14,31.97
  Top 0.813: IC1.16 IC1.1
  Bottom 0.406: v63.97,56.17 63.97,46 v63.28,45.31 63.28,32.23 C26.1
  Bottom 0.61: C19.1 49.91,18.71 49.17,19.45
  Bottom 0.813: IC1.16 46.48,16.76 49.17,19.45 56.9,27.18 56.9,27.65 5VREG.3 | IC1.1 46.48,4.57 47.84,3.21 62.65,3.21 63.25,3.81 63.88,4.45 64.26,4.83 IC1.8 IC1.9 64.24,13.99 C20.1
  Bottom 1.016: C4.1 44.02,8.81 IC1.1
12V
  Bottom 0.305: U$1.2 U$1.1
  Bottom 0.406: C11.1 4.08,68.09 5.33,69.34 5.33,70.61 5.59,70.87 6.34,70.87 U$1.1
  Bottom 0.61: D2.A 25.15,64.01 26.92,65.79 32.26,65.79 33.47,66.99 Q1.GATE | C11.1 3.56,65.55 C10.1
  Bottom 0.813: Q2.1 62.74,64.78 61.47,63.5 R3.1
  Bottom 1.016: C10.1 3.81,65.3 3.81,58.67 10.16,52.32 J1.PWR 11.16,60.69 14.13,63.66 D2.A | R3.1 59.62,60.89 56.9,58.17 28.45,58.17 27.18,59.44 27.18,60.39 R2.2 25.15,62.55 25.15,64.01
ADC_CELL1
  Top 0.254: U1.17 25.74,43.88 19.29,50.33 19.29,54.71 16.57,57.43 R23.2
  Top 0.305: R23.2 15.47,59.23 R22.1
ADC_CELL2  (2 unrouted)
BOOT1
  Top 0.254: U1.28 R18.1
CELL1
  Top 0.305: X1.P$3 12.13,71.35 12.46,71.02 12.46,62.64 14.12,60.97 R22.2
COIL_A1
  Top 0.61: P.1 69.31,5.8 67.06,3.56 50.04,3.56 49.02,4.57 IC1.2
  Top 0.813: IC1.2 49.02,8.62 C15.1
COIL_A2
  Top 0.61: P.3 66.12,8.3 64.26,10.16 49.78,10.16 49.02,10.92 49.02,11.56 | 49.02,11.94 IC1.15 49.02,11.56 | C18.1 49.02,11.56
COIL_B1
  Top 0.61: P.2 68.52,7.05 66.04,4.57 63.5,4.57 IC1.7
  Top 0.813: IC1.7 61.72,8.75 C16.1
COIL_B2
  Top 0.61: P.4 66.77,9.55 64.77,11.56 C17.1
  Top 0.813: IC1.10 61.72,11.57 C17.1
D+
  Top 0.254: 5.26,20.24 5.49,20.47 R15.2 | 5.26,20.24 4.27,20.24 J2.D+ | R13.1 5.52,18.96 5.37,19.11 5.37,20.13 5.26,20.24
ESP_CH_PD
  Top 0.254: ESP8266.6 5.05,37.38 5.8,36.63 5.8,30.87 R24.1
ESP_GPIO0
  Top 0.254: ESP8266.3 13.36,34.84 19.46,40.93 26.01,40.93 26.67,40.27 26.67,39.37 27.15,38.89 U1.27
ESP_GPIO2
  Top 0.254: ESP8266.5 15.09,37.38 19.05,41.34 26.21,41.34 27.05,40.5 27.05,39.69 27.36,39.38 U1.26
ESP_RST
  Top 0.254: S2.2 S2.1 6.15,27.51 R25.1 5.32,29.82 5.32,34.59 5.08,34.84 ESP8266.4 | C42.1 12.33,29.08 | 12.33,29.08 12.6,29.08 T2.3 | S2.2 11.9,28.65 12.33,29.08 | R26.1 12.57,26.67 S2.2
ESP_RX
  Top 0.254: ESP8266.1 21.61,32.3 27.2,37.88 U1.29
ESP_TX  (via drill 0.6)
  Top 0.254: U1.30 27.31,37.38 26.12,36.2 v26.12,35.41
  Bottom 0.254: ESP8266.8 4.28,39.28 4.95,38.61 20.84,38.61 24.04,35.41 v26.12,35.41
GND  (via drill 0.5, 0.6)  (13 unrouted)
  Top 0.254: C5.2 38.39,58.91 C27.2 C28.2 | R14.2 3,27.71 4.86,25.84 | 4.86,25.84 4.86,24 5.33,23.53 S2.3 S2.4 12.71,22.72 16.7,22.72 17.83,23.85 19.14,23.85 19.55,24.26 19.55,24.87 17.77,26.64 17.77,26.66 | 4.86,25.84 16.26,25.84 16.79,26.38 16.79,29.97 16.51,30.25 15.09,30.25 T2.2 | JP2.1 18.91,29.34 17.77,28.19 17.77,26.66 | 17.77,26.66 19.57,24.85 19.57,23.89 | 19.57,23.89 19.57,23.86 | 19.58,23.88 19.57,23.89 | 54.08,14.63 54.08,13.41 54.1,13.39 | JP4.1 13.69,47.33 13.4,47.62 | U1.31 v29.39,36.88 | U1.18 28.89,43.38 v29.38,43.9 | U1.47 37.03,35.61 v36.85,35.75 | U1.63 38.28,43.38 v38.1,43.2 | U3.8 60.03,47.74 v59.44,48.34 | v59.45,54.95 58.14,54.95 C32.2 | JP3.4 49.89,33.2 51.09,31.99 61.02,31.99 C26.2 61.27,32.19 U2.8 | R19.1 32.03,47.17 U1.12 32.03,45.22 31.9,45.09 | J2.GND 4.58,18.97 5.77,17.78 16.51,17.78 v20.16,21.43
  Top 0.305: J1.GNDBREAK 13.4,47.62 13.68,47.62 15.49,49.44 15.49,55.72 R23.1 | T1.2 40.73,23.6 41.85,23.6 42.22,23.23 42.22,20.97 R9.1 41.38,17.62 C22.2 41.08,11.48 C4.2 | U1.63 43.81,43.38 44.74,44.31 C38.2 48.09,44.68 48.82,45.4 48.82,48.18 48.25,48.76 44.77,48.76 C39.2 44.74,54.27 42.74,56.27 39.22,56.27 C27.2 | C42.2 8.13,30.13 8.39,30.39 14.95,30.39 T2.2 | 5.33,23.53 11.87,23.53 11.91,23.5 11.99,23.5 12.74,22.75 16.71,22.75 17.82,23.85 19.27,23.85 19.28,23.84 19.49,23.84 19.53,23.88 19.53,22.05 v20.16,21.43
  Top 0.406: C32.2 57.97,65.49 C13.2 | J2.GND 4.25,6.11 8.13,2.23 12.19,2.23 JP5.1 JP5.3
  Top 0.61: J1.GNDBREAK 8.16,46.2 C41.2 6.82,44.24 ESP8266.7 5.88,40.86 3.31,40.86 2.08,39.62 C40.2
  Top 0.813: C15.2 53.47,8.76 53.98,8.26 53.98,6.48 IC1.4 | C16.2 57.15,8.76 56.64,8.26 IC1.5 | C17.2 57.02,11.56 56.64,11.94 IC1.12 | C18.2 53.59,11.56 54.1,12.06 54.1,13.39 IC1.13
  Top 1.016: C5.2 36.34,60.96 35.31,60.96 26.4,69.86 20.43,69.86 18.95,71.35 X1.P$1 | U$2.18 74.17,45.72 75.44,46.99 U$2.17 | C19.2 59.07,23.28 61.28,23.28 66.72,28.72 C24.2 69.55,26.51 C3.2 | C4.2 41.25,12 45.25,16 45.25,16.02 45.67,16.43 51.64,16.43 IC1.13
  Bottom 0.254: C10.2 6.08,65.15 7.04,64.19 7.04,62.75 R1.2 | v29.39,36.88 30.7,36.88 C31.2 | v29.38,43.9 30.13,43.9 C34.2 30.41,44.65 29.21,44.65 27.39,46.47 C36.2 25.32,46.47 C33.2 | v36.85,35.75 36.85,36.4 C30.2 | v38.1,43.2 37.42,43.2 C35.2 | v59.44,48.34 59.44,54.94 v59.45,54.95
  Bottom 0.305: C10.2 6.08,65.77 7.37,67.06 U$1.8 U$1.9 | v20.16,21.43 31.13,21.43 C4.2
  Bottom 0.406: C35.2 36.79,42 C37.C | C37.C | C31.2 30.7,38.44 31.27,39.01 33.29,39.01 | 33.29,39.01 C37.C | C30.2 36.34,38.55 35.87,39.03 33.3,39.03 33.29,39.01
  Bottom 0.61: R2.1 36.3,60.45 C5.2 | C12.2 6.08,75.93 7.11,76.96 | C11.2 1.79,70.09 1.02,70.87 | C26.2 61.04,30.27 62.4,28.92 67.14,28.92 C24.2
  Bottom 0.813: R3.2 57.66,63.57 C13.2 57.17,65.81 57.15,65.79 54.88,65.79 C14.2 | 3.3VREG.1 42.92,62.48 41.4,60.96 39.89,60.96 C8.2 40.13,60.73 C2.2 | U$2.13 78.99,41.91 80.52,40.39 80.52,26.16 77.22,22.86 72.39,22.86 70.38,20.85 5VREG.1 56.64,17.81 56.64,14.48 | IC1.12 56.64,14.48 | IC1.12 IC1.13 54.08,13.99 C19.2 | IC1.4 IC1.5 56.63,6.34 56.63,4.69 57.01,4.3 59.66,4.3 60.47,5.11 60.47,15.35 60.43,15.39 60.41,15.39 59.85,15.95 58.13,15.95 56.64,14.46 IC1.12 | C20.2 60.45,18.29 56.64,14.48
  Bottom 1.016: C14.2 54.61,65.79 49.78,60.96 48.02,60.96 C6.2 45.21,60.98 C2.2 | C8.2 36.58,60.98 C5.2 | X1.P$1 13.97,73.41 10.41,76.96 | 10.41,76.96 7.11,76.96 2.79,76.96 1.02,75.18 1.02,70.87 1.02,56.47 J1.GND 8.16,49.32 J1.GNDBREAK | U$2.13 U$2.15 U$2.17 78.74,46.99 80.77,49.02 80.77,70.36 72.39,78.74 11.94,78.74 10.41,77.22 10.41,76.96 | U$2.14 U$2.16 U$2.18 | C13.2 57.92,65.55 C1.2 60.98,65.55 61.47,66.04 64.26,66.04 65.02,65.28 65.02,63.25 66.04,62.23 67.54,62.23 C25.2
HEAD_UP_IN  (3 unrouted)
IO_BATT_STAT  (via drill 0.6)
  Top 0.254: U1.20 25.83,42.38 18.16,50.05 18.16,54.7 16.26,56.6 13.51,56.6 9.88,60.24 v9.88,63.64
  Bottom 0.254: v9.88,63.64 9.88,64.12 R27.1
  Bottom 0.305: U$1.7 7.87,66.14 R27.1
IO_CLOCK  (via drill 0.5)
  Top 0.254: U$2.6 79.53,30.48 80.16,31.11 | U2.12 67.97,40.23 v68.48,39.73
  Bottom 0.254: v68.48,39.73 68.48,32.68 70.67,30.48 U$2.6
IO_COIL_A1  (1 unrouted)
IO_COIL_A2  (1 unrouted)
IO_COIL_B1  (1 unrouted)
IO_COIL_B2  (1 unrouted)
IO_DATA
  Top 0.254: U3.2 65.44,55.36 66.08,55.99 69.84,55.99 71.01,57.16 77.46,57.16 U$2.25
IO_HEAD_UP  (1 unrouted)
IO_LATCH  (via drill 0.5)
  Top 0.254: U2.6 63.35,38.96 v64.28,38.38 | U$2.5 70.33,31.75 v69.15,30.57
  Bottom 0.254: 69.05,30.57 v69.15,30.57 64.28,35.45 v64.28,38.38
IO_PAPER_SENSOR  (1 unrouted)
  Top 0.305: T1.3 36.81,24.1 R6.1
IO_STB1
  Top 0.254: U2.2 65.19,44.04 65.81,43.42 67.89,43.42 70.24,41.07 70.24,36.59 71.26,35.57 72.38,35.57 U$2.10
IO_STB2
  Top 0.254: U2.15 68.97,44.04 71.12,41.9 73.81,41.9 74.92,40.79 74.92,37.87 75.96,36.83 U$2.9
IO_STB3  (via drill 0.5)
  Top 0.254: U2.4 65.22,41.5 65.81,40.91 68.4,40.91 69.41,39.9 69.41,35.47 v69.42,35.46
  Bottom 0.254: v69.42,35.46 69.42,34.02 70.43,33.01 72.38,33.01 U$2.8
IO_STB4
  Top 0.254: U3.12 69.04,51.55 71.11,49.48 74.88,49.48 U$2.21
IO_STB5
  Top 0.254: U3.4 65.38,52.82 66.02,52.18 71.01,52.18 U$2.22
IO_STB6
  Top 0.254: U$2.23 68.45,54.61 67.7,55.36 U3.15
IO_THERM_OUT
  Bottom 0.254: U$2.12 72.15,38.1 70.42,39.83 70.42,39.84 68.44,41.82 68.44,45.09 66.84,46.69 64.9,46.69 R12.1 64.88,46.7 64.88,46.53 64.86,46.56
LED_ANODE  (1 unrouted)
MCU_CLOCK
  Top 0.254: U1.53 50.47,38.38 51.71,39.62 65.38,39.62 66.04,38.96 U2.11
MCU_DATA
  Top 0.254: U1.62 48.22,42.88 59.42,54.09 U3.3
MCU_LATCH
  Top 0.254: U1.52 60.24,37.88 60.44,37.68 U2.7
MCU_STB1
  Top 0.254: U1.57 49.76,40.38 52.16,42.79 61.26,42.79 U2.3
MCU_STB2
  Top 0.254: U1.56 49.98,39.88 52.27,42.18 65.11,42.18 65.68,42.75 66.85,42.75 U2.14
MCU_STB3
  Top 0.254: U1.54 50.2,38.88 51.56,40.25 61.26,40.25 U2.5
MCU_STB4
  Top 0.254: U1.58 49.62,40.88 59.65,50.91 65.28,50.91 65.91,50.28 U3.11
MCU_STB5
  Top 0.254: U1.59 49.38,41.38 59.56,51.56 61.25,51.56 U3.5
MCU_STB6
  Top 0.254: U1.61 48.43,42.38 59.5,53.45 65.28,53.45 65.91,54.09 U3.14
N$1
  Top 0.254: U1.7 34.53,45.17 34.14,44.78 30.58,44.78 30.3,44.5 30.3,35.76 29.68,35.14 28.27,35.14 24.91,31.77 18.2,31.77 17.3,30.87 17.3,24.73 16.42,23.85 S1.1
N$2
  Bottom 0.61: Q1.SOURCE-1 35.69,72.01 37.08,70.61 37.08,64.82 37.11,64.8 | D2.C 28.96,64.01 31.24,61.72 35.07,61.72 C5.1
  Bottom 0.813: C5.1 36.58,64.26 37.11,64.8 3.3VREG.2 38.39,64.77 39.37,64.77 39.88,64.26 C8.1
N$3
  Top 0.305: R7.2 41.38,22.35 T1.1
N$4
  Bottom 0.254: U$1.10 6.37,67.62 4.74,65.99 4.74,64.57 R1.1
N$5
  Top 0.305: C28.1 30.44,51.8 Y1.2 33.93,51.79 35.03,50.69 U1.6
N$6  (via drill 0.5)
  Top 0.254: U1.13 31.53,47.93 v31.37,48.09
  Bottom 0.254: v31.37,48.09 31.37,48.28 L1.2
N$7
  Top 0.305: C27.1 40.08,55.44 Y1.1 36.6,51.79 35.53,50.72 U1.5
N$8  (via drill 0.5)
  Top 0.254: JP1.1 v49.03,54.97 | v37.53,47.19 U1.1
  Bottom 0.254: v49.03,54.97 45.21,54.97 v37.53,47.19
N$9
  Bottom 0.406: X2.P$2 21.59,71.12
  Bottom 0.61: Q1.DRAIN-4 22.25,72.01 X2.P$2
N$10
  Top 0.305: U1.3 36.54,44.95 36.61,44.87 37.76,44.87 38.34,45.45 Y2.X2 39.89,45.48 40.56,45.48 41.36,44.68 C38.1
N$11
  Top 0.305: U1.4 36.03,47.48 36.55,47.99 Y2.X1 39.89,47.97 40.55,47.97 41.36,48.78 C39.1
N$12
  Top 0.254: R14.1 0.93,25.68 0.3,25.06 0.3,22.91 0.88,22.34 2.2,22.34 2.68,21.86 2.68,20.07 3.12,19.62 J2.ID
N$14
  Top 0.254: J2.D- 5.07,20.92 R16.2
N$15  (via drill 0.6)
  Top 0.254: v22.64,38.38 R18.2
  Bottom 0.254: JP4.2 16.23,44.79 v22.64,38.38
N$16  (1 unrouted)
N$17
  Top 0.254: R26.2 T2.1
N$19
  Top 0.254: JP2.2 21.12,29.96 20.69,29.53 R11.1
N$20  (via drill 0.5)
  Top 0.254: U1.15 v30.53,47.48 30.53,48.45 30.92,48.84 33.83,48.84 34.14,48.54 R19.2
  Bottom 0.254: R12.2 38.42,46.76 37.66,46 32.02,46 v30.53,47.48
NRST  (via drill 0.5)  (1 unrouted)
  Top 0.254: S1.2 20.99,23.85 25.34,28.19 25.34,30.64 v29.03,34.34
  Bottom 0.254: v29.03,34.34 44.15,34.34 JP3.2
PH_TRANS_COLLECTOR
  Top 0.254: R8.1 R7.1 R9.2 C22.1
  Top 0.305: C22.1 43.45,17.32 43.54,17.41 52.59,17.41 54.2,15.8 64.76,15.8 66.06,14.49 66.06,12.05 67.3,10.82 71.14,10.82 P.5
SPI_SS  (1 unrouted)
SWD_CLOCK
  Top 0.254: U1.49 46.41,36.38 47.8,34.99 51.12,34.99 JP3.5
SWD_DATA
  Top 0.254: U1.46 36.53,33.59 36.85,33.26 41.85,33.26 JP3.1
USB_D+  (via drill 0.6)
  Top 0.254: R15.1 v9.09,20.47 | v35.9,31.6 35.9,31.76 35.08,32.59 35.08,33.38 35.53,33.83 U1.44
  Bottom 0.254: v9.09,20.47 16.32,20.47 19.76,23.91 28.22,23.91 v35.9,31.6
USB_D-  (via drill 0.6)
  Top 0.254: R16.1 v9.23,22.01 | U1.45 36.03,33.17 v35.88,33.02
  Bottom 0.254: v9.23,22.01 16.38,22.01 19.32,24.94 27.8,24.94 v35.88,33.02
V_BATT  (1 unrouted)
  Bottom 0.305: U$1.3 U$1.4 | U$1.4 8.86,70.89 9.91,69.85 12.47,69.85 X1.P$2 | 7.11,71.63 7.13,71.63 U$1.4
  Bottom 0.406: C12.1 4.06,72.9 5.33,71.63 7.11,71.63
  Bottom 0.813: Q2.2 62.49,69.34 61.72,70.1 56.66,70.1 C14.1
  Bottom 1.016: X2.P$1 14.48,68.35 | 14.48,68.35 X1.P$2 | C14.1 54.61,69.34 47.24,76.71 19.05,76.71 17.53,75.18 17.53,71.4 14.48,68.35
VCC  (1 unrouted)
  Top 1.016: C3.1 67.98,19.54 67.37,20.14 67.37,26.18 C24.1
  Bottom 0.813: 57.91,68.06 C13.1 | 72.39,58.19 U$2.28 | 5VREG.2 55.12,21.09 57.4,23.37 70.36,23.37 U$2.2
  Bottom 1.016: C25.1 68.81,59.71 70.1,58.42 U$2.28 | C24.1 71.57,26.22 U$2.2 | U$2.3 U$2.1
  Bottom 1.27: U$2.28 72.39,62.74 70.06,65.06 Q2.3 69.57,67.55 C1.1 58.42,67.55 C13.1 | U$2.27 73.66,59.69 U$2.28 | U$2.28 U$2.26 73.91,55.88 74.93,54.86 74.93,26.92 74.68,26.67 | 74.68,26.67 73.41,25.4 U$2.2 | U$2.1 74.68,26.67
WKUP  (1 unrouted)